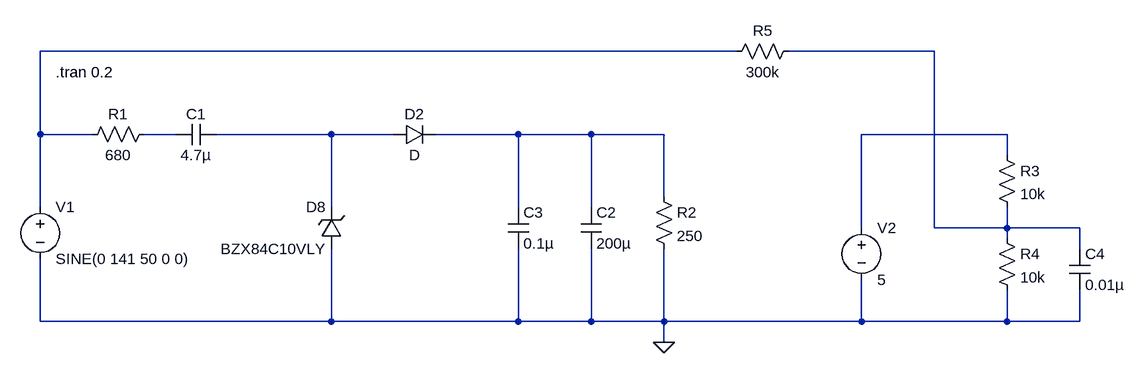
[diagram p0: schematic sim_ver2.asc]
sim_ver2.asc, the LTspice schematic file:
Version 4
SHEET 1 2076 680
WIRE 1472 -224 400 -224
WIRE 1776 -224 1552 -224
WIRE 400 -96 400 -224
WIRE 480 -96 400 -96
WIRE 608 -96 560 -96
WIRE 848 -96 672 -96
WIRE 944 -96 848 -96
WIRE 1136 -96 1008 -96
WIRE 1248 -96 1136 -96
WIRE 1360 -96 1248 -96
WIRE 1888 -96 1664 -96
WIRE 1888 -64 1888 -96
WIRE 1360 0 1360 -96
WIRE 400 16 400 -96
WIRE 848 16 848 -96
WIRE 1136 16 1136 -96
WIRE 1248 16 1248 -96
WIRE 1664 48 1664 -96
WIRE 1776 48 1776 -224
WIRE 1888 48 1888 16
WIRE 1888 48 1776 48
WIRE 2000 48 1888 48
WIRE 1888 64 1888 48
WIRE 2000 80 2000 48
WIRE 400 192 400 96
WIRE 848 192 848 80
WIRE 848 192 400 192
WIRE 1136 192 1136 80
WIRE 1136 192 848 192
WIRE 1248 192 1248 80
WIRE 1248 192 1136 192
WIRE 1360 192 1360 80
WIRE 1360 192 1248 192
WIRE 1664 192 1664 128
WIRE 1664 192 1360 192
WIRE 1888 192 1888 144
WIRE 1888 192 1664 192
WIRE 2000 192 2000 144
WIRE 2000 192 1888 192
WIRE 1360 224 1360 192
FLAG 1360 224 0
SYMBOL voltage 400 0 R0
WINDOW 123 0 0 Left 0
WINDOW 39 0 0 Left 0
SYMATTR InstName V1
SYMATTR Value SINE(0 141 50 0 0)
SYMBOL res 576 -112 R90
WINDOW 0 0 56 VBottom 2
WINDOW 3 32 56 VTop 2
SYMATTR InstName R1
SYMATTR Value 680
SYMATTR SpiceLine pwr=1
SYMBOL cap 672 -112 R90
WINDOW 0 0 32 VBottom 2
WINDOW 3 32 32 VTop 2
SYMATTR InstName C1
SYMATTR Value 4.7µ
SYMBOL cap 1232 16 R0
SYMATTR InstName C2
SYMATTR Value 200µ
SYMBOL res 1344 -16 R0
SYMATTR InstName R2
SYMATTR Value 250
SYMBOL voltage 1664 32 R0
WINDOW 123 0 0 Left 0
WINDOW 39 0 0 Left 0
SYMATTR InstName V2
SYMATTR Value 5
SYMBOL res 1872 -80 R0
SYMATTR InstName R3
SYMATTR Value 10k
SYMBOL res 1872 48 R0
SYMATTR InstName R4
SYMATTR Value 10k
SYMBOL res 1568 -240 R90
WINDOW 0 0 56 VBottom 2
WINDOW 3 32 56 VTop 2
SYMATTR InstName R5
SYMATTR Value 300k
SYMATTR SpiceLine pwr=1
SYMBOL cap 1120 16 R0
SYMATTR InstName C3
SYMATTR Value 0.1µ
SYMBOL cap 1984 80 R0
SYMATTR InstName C4
SYMATTR Value 0.01µ
SYMBOL zener 864 80 R180
WINDOW 0 24 64 Left 2
WINDOW 3 24 0 Left 2
SYMATTR InstName D8
SYMATTR Value BZX84C10VLY
SYMATTR Description Diode
SYMATTR Type diode
SYMBOL diode 944 -80 R270
WINDOW 0 32 32 VTop 2
WINDOW 3 0 32 VBottom 2
SYMATTR InstName D2
TEXT 424 -192 Left 2 !.tran 0.2

The netlist it stands for:
* sim_ver2.asc
V1 N001 0 SINE(0 141 50 0 0)
R1 N003 N001 680 pwr=1
C1 N004 N003 4.7µ
C2 N005 0 200µ
R2 N005 0 250
V2 N006 0 5
R3 N006 N002 10k
R4 N002 0 10k
R5 N002 N001 300k pwr=1
C3 N005 0 0.1µ
C4 N002 0 0.01µ
D8 0 N004 BZX84C10VLY
D2 N004 N005 D
.model D D
.lib standard.dio
.tran 0.2
.backanno
.end